# EAGLE design Shruthi-Analog-SMR4-mkII-v01 (EAGLE 5.09)
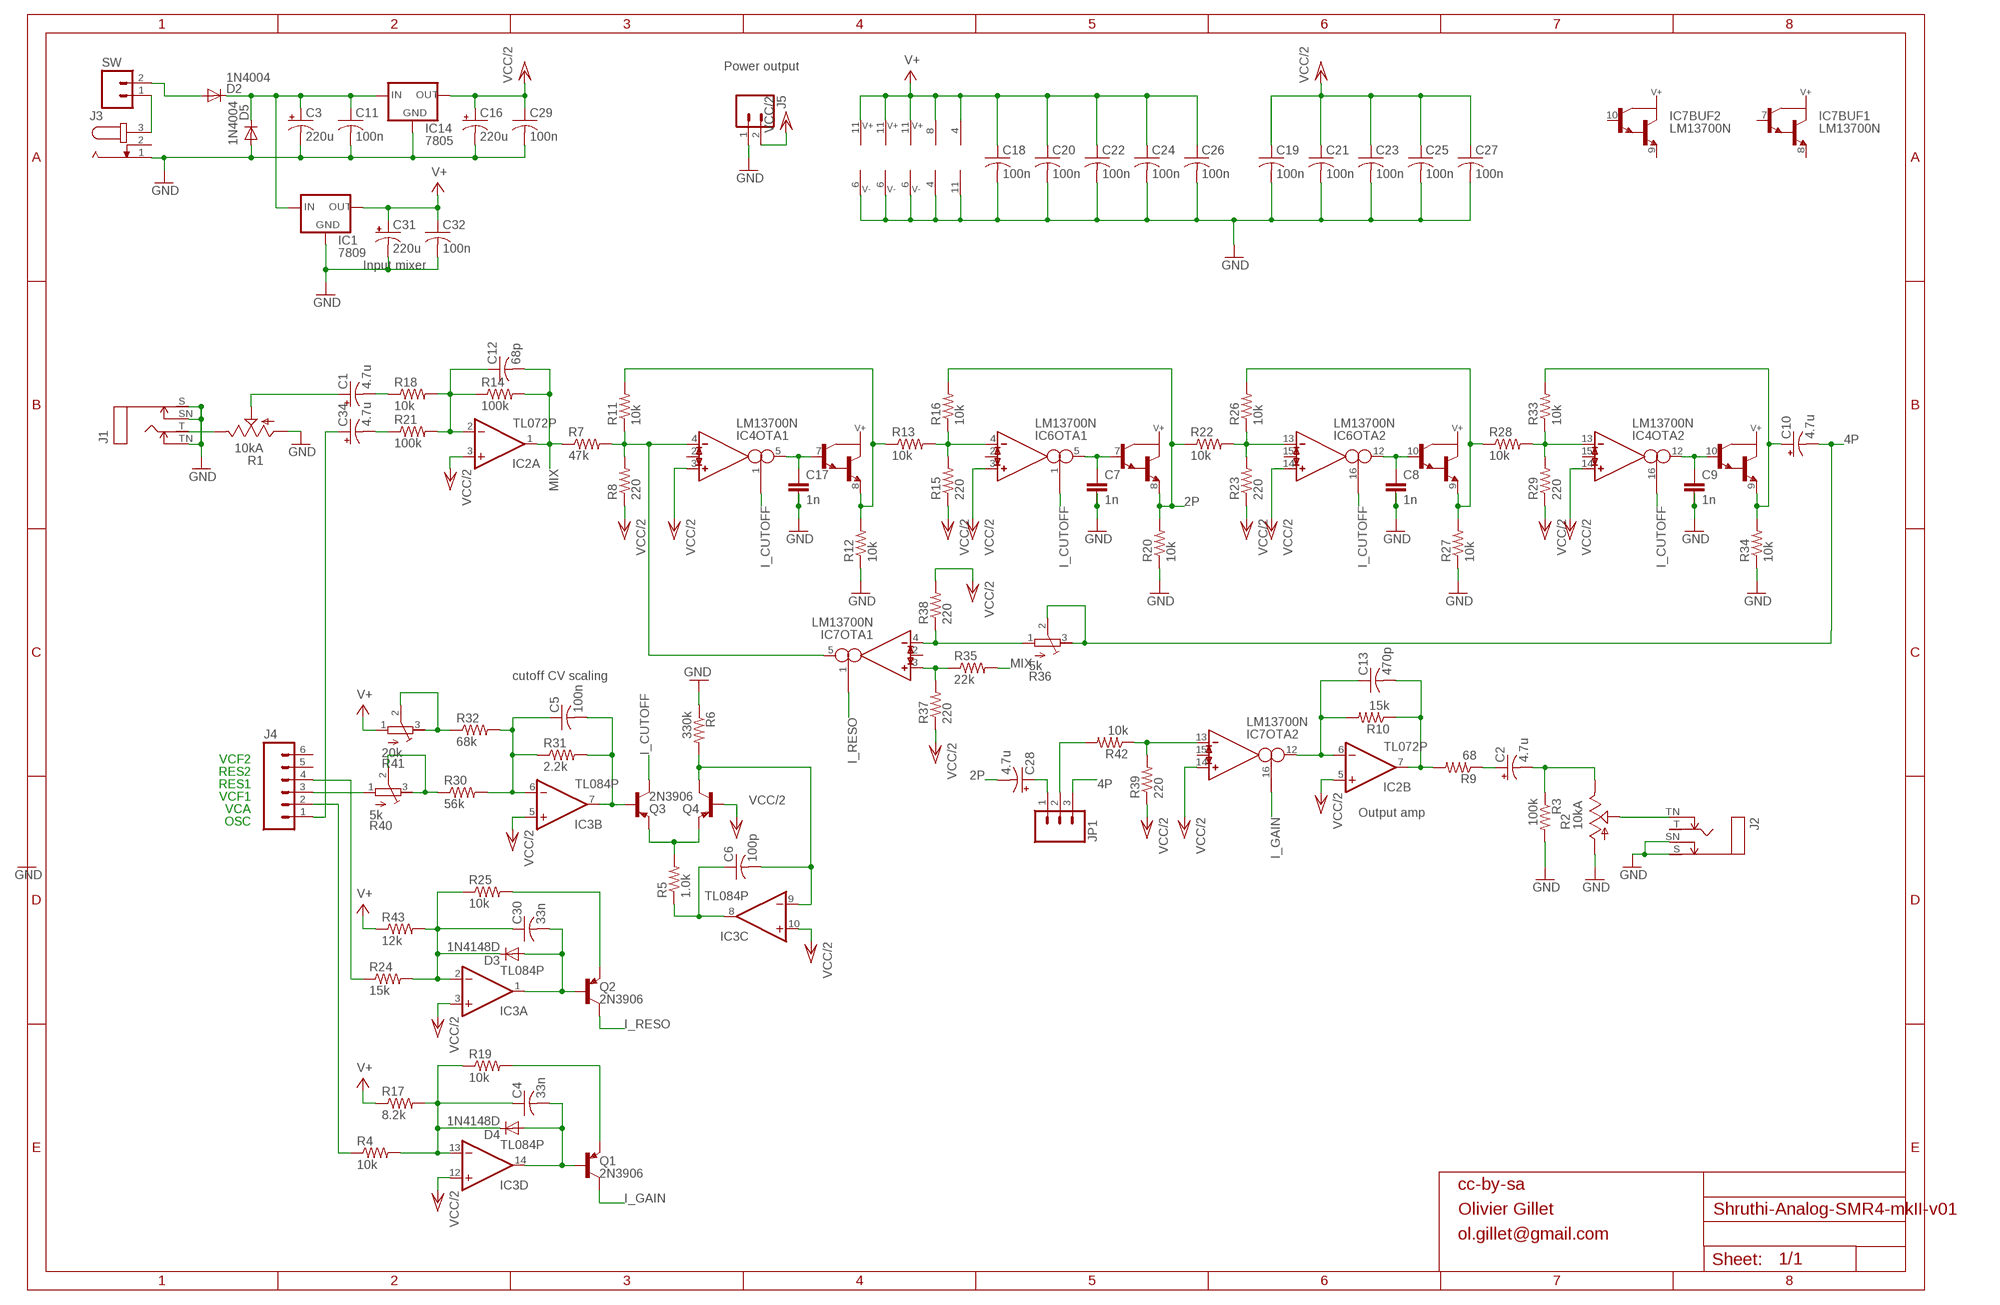
[diagram p0: schematic, sheet 1]

## Parts
C1  4.7u  CPOL-USE2.5-6  [E2,5-6]
C2  4.7u  CPOL-USE2.5-6  [E2,5-6]
C3  220u  CPOL-USE5-10.5  [E5-10,5]
C4  33n  C-US050-025X075  [C050-025X075]
C5  100n  C-US025-025X050  [C025-025X050]
C6  100p  C-US025-025X050  [C025-025X050]
C7  1n  C-2.5-5/2  [C2.5/5-2]
C8  1n  C-2.5-5/2  [C2.5/5-2]
C9  1n  C-2.5-5/2  [C2.5/5-2]
C10  4.7u  CPOL-USE2.5-6  [E2,5-6]
C11  100n  C-US025-025X050  [C025-025X050]
C12  68p  C-US025-025X050  [C025-025X050]
C13  470p  C-US025-025X050  [C025-025X050]
C16  220u  CPOL-USE5-10.5  [E5-10,5]
C17  1n  C-2.5-5/2  [C2.5/5-2]
C18  100n  C-US025-025X050  [C025-025X050]
C19  100n  C-US025-025X050  [C025-025X050]
C20  100n  C-US025-025X050  [C025-025X050]
C21  100n  C-US025-025X050  [C025-025X050]
C22  100n  C-US025-025X050  [C025-025X050]
C23  100n  C-US025-025X050  [C025-025X050]
C24  100n  C-US025-025X050  [C025-025X050]
C25  100n  C-US025-025X050  [C025-025X050]
C26  100n  C-US025-025X050  [C025-025X050]
C27  100n  C-US025-025X050  [C025-025X050]
C28  4.7u  CPOL-USE2.5-6  [E2,5-6]
C29  100n  C-US025-025X050  [C025-025X050]
C30  33n  C-US050-025X075  [C050-025X075]
C31  220u  CPOL-USE5-10.5  [E5-10,5]
C32  100n  C-US025-025X050  [C025-025X050]
C34  4.7u  CPOL-USE2.5-6  [E2,5-6]
D2  1N4004  [DO41-10]
D3  1N4148D  DIODE-D-5  [D-5]
D4  1N4148D  DIODE-D-5  [D-5]
D5  1N4004  [DO41-10]
IC1  7809  78XXS  [78XXS]
IC2  TL072P  [DIL08]
IC3  TL084P  [DIL14]
IC4  LM13700N  [DIL16]
IC6  LM13700N  [DIL16]
IC7  LM13700N  [DIL16]
IC14  7805  78XXS  [78XXS]
J1  MONOSWS  [NMJ4HC-S]
J2  MONOSWS  [NMJ4HC-S]
J3  JACK-PLUG1  [SPC4078]
J4  M06SIP  [1X06]
J5  M02PTH  [1X02]
JP1  M03PTH  [1X03]
Q1  2N3906  2N3906-  [TO92-]
Q2  2N3906  2N3906-  [TO92-]
Q3  2N3906  2N3906-  [TO92-]
Q4  2N3906  2N3906-  [TO92-]
R1  10kA  POT_USCABLED  [CABLE_POT_6MM]
R2  10kA  POT_USCABLED  [CABLE_POT_6MM]
R3  100k  R-US_0204/7  [0204/7]
R4  10k  R-US_0204/7  [0204/7]
R5  1.0k  R-US_0204/7  [0204/7]
R6  330k  R-US_0204/7  [0204/7]
R7  47k  R-US_0204/7  [0204/7]
R8  220  R-US_0204/7  [0204/7]
R9  68  R-US_0204/7  [0204/7]
R10  15k  R-US_0204/7  [0204/7]
R11  10k  R-US_0204/7  [0204/7]
R12  10k  R-US_0204/7  [0204/7]
R13  10k  R-US_0204/7  [0204/7]
R14  100k  R-US_0204/7  [0204/7]
R15  220  R-US_0204/7  [0204/7]
R16  10k  R-US_0204/7  [0204/7]
R17  8.2k  R-US_0204/7  [0204/7]
R18  10k  R-US_0204/7  [0204/7]
R19  10k  R-US_0204/7  [0204/7]
R20  10k  R-US_0204/7  [0204/7]
R21  100k  R-US_0204/7  [0204/7]
R22  10k  R-US_0204/7  [0204/7]
R23  220  R-US_0204/7  [0204/7]
R24  15k  R-US_0204/7  [0204/7]
R25  10k  R-US_0204/7  [0204/7]
R26  10k  R-US_0204/7  [0204/7]
R27  10k  R-US_0204/7  [0204/7]
R28  10k  R-US_0204/7  [0204/7]
R29  220  R-US_0204/7  [0204/7]
R30  56k  R-US_0204/7  [0204/7]
R31  2.2k  R-US_0204/7  [0204/7]
R32  68k  R-US_0204/7  [0204/7]
R33  10k  R-US_0204/7  [0204/7]
R34  10k  R-US_0204/7  [0204/7]
R35  22k  R-US_0204/7  [0204/7]
R36  5k  R-TRIMM3296W  [RTRIM3296W]
R37  220  R-US_0204/7  [0204/7]
R38  220  R-US_0204/7  [0204/7]
R39  220  R-US_0204/7  [0204/7]
R40  5k  R-TRIMM3296W  [RTRIM3296W]
R41  20k  R-TRIMM3296W  [RTRIM3296W]
R42  10k  R-US_0204/7  [0204/7]
R43  12k  R-US_0204/7  [0204/7]
SW  M02PTH  [1X02]

## Nets
2P: C28.- IC6.8(BUF1:E) R16.2 R20.2 R22.1
4P: C10.- JP1.3 R36.2(S) R36.3(A)
GND: C3.- C7.2 C7.3 C8.2 C8.3 C9.2 C9.3 C11.2 C16.- C17.2 C17.3 C18.2 C19.2 C20.2 C21.2 C22.2 C23.2 C24.2 C25.2 C26.2 C27.2 C29.2 C31.- C32.2 D5.A IC1.GND IC2.4(P:V-) IC3.11(P:V-) IC4.6(SUPPLY:V-) IC6.6(SUPPLY:V-) IC7.6(SUPPLY:V-) IC14.GND J1.S J1.SN J1.TN J2.S J2.SN J3.1 J5.1 R1.A R2.A R3.2 R6.1 R12.1 R20.1 R27.1 R34.1
I_CUTOFF: IC4.1(OTA1:I_BIAS) IC4.16(OTA2:I_BIAS) IC6.1(OTA1:I_BIAS) IC6.16(OTA2:I_BIAS) Q3.1(C)
I_GAIN: IC7.16(OTA2:I_BIAS) Q1.1(C)
I_RESO: IC7.1(OTA1:I_BIAS) Q2.1(C)
MIX: C12.2 IC2.1(A:OUT) R7.1 R14.2 R35.2
N$1: D2.A SW.2
N$2: C5.2 IC3.7(B:OUT) Q3.2(B) R31.2
N$3: J3.3 SW.1
N$4: C3.+ C11.1 D2.C D5.C IC1.IN IC14.IN
N$5: J4.3 R40.1(E)
N$6: C12.1 IC2.2(A:-IN) R14.1 R18.2 R21.2
N$7: Q3.3(E) Q4.3(E) R5.2
N$8: JP1.2 R42.2
N$9: C6.1 IC3.8(C:OUT) R5.1
N$10: C6.2 IC3.9(C:-IN) Q4.1(C) R6.2
N$11: J4.4 R24.1
N$12: IC4.4(OTA1:IN_N) IC7.5(OTA1:OUT) R7.2 R8.2 R11.1
N$14: IC4.8(BUF1:E) R11.2 R12.2 R13.1
N$16: IC6.4(OTA1:IN_N) R13.2 R15.2 R16.1
N$17: C28.+ JP1.1
N$19: C7.1 IC6.5(OTA1:OUT) IC6.7(BUF1:B)
N$20: IC6.13(OTA2:IN_N) R22.2 R23.2 R26.1
N$23: C8.1 IC6.10(BUF2:B) IC6.12(OTA2:OUT)
N$24: IC4.13(OTA2:IN_N) R28.2 R29.2 R33.1
N$25: C2.+ R9.1
N$26: IC6.9(BUF2:E) R26.2 R27.2 R28.1
N$27: C10.+ IC4.9(BUF2:E) R33.2 R34.2
N$28: C9.1 IC4.10(BUF2:B) IC4.12(OTA2:OUT)
N$29: IC7.4(OTA1:IN_N) R36.1(E) R38.1
N$30: C30.2 D3.A IC3.1(A:OUT) Q2.2(B)
N$31: C4.2 D4.A IC3.14(D:OUT) Q1.2(B)
N$32: C2.- R2.E R3.1
N$33: IC7.3(OTA1:IN_P) R35.1 R37.2
N$34: IC7.13(OTA2:IN_N) R39.2 R42.1
N$35: C34.+ J4.1
N$38: J1.T R1.E
N$39: C34.- R21.1
N$40: C5.1 IC3.6(B:-IN) R30.2 R31.1 R32.2
N$41: R30.1 R40.2(S) R40.3(A)
N$43: R32.1 R41.2(S) R41.3(A)
N$45: J4.2 R4.1
N$47: J2.TN R2.S
N$51: C4.1 D4.C IC3.13(D:-IN) R4.2 R17.2 R19.1
N$57: C30.1 D3.C IC3.2(A:-IN) R24.2 R25.1 R43.2
N$60: Q2.3(E) R25.2
N$63: C13.2 IC2.7(B:OUT) R9.2 R10.1
N$64: C17.1 IC4.5(OTA1:OUT) IC4.7(BUF1:B)
N$66: C1.+ R1.S
N$68: Q1.3(E) R19.2
N$70: C13.1 IC2.6(B:-IN) IC7.12(OTA2:OUT) R10.2
N$72: C1.- R18.1
V+: C18.1 C20.1 C22.1 C24.1 C26.1 C31.+ C32.1 IC1.OUT IC2.8(P:V+) IC3.4(P:V+) IC4.11(SUPPLY:V+) IC6.11(SUPPLY:V+) IC7.11(SUPPLY:V+) R17.1 R41.1(E) R43.1
VCC/2: C16.+ C19.1 C21.1 C23.1 C25.1 C27.1 C29.1 IC2.3(A:+IN) IC2.5(B:+IN) IC3.3(A:+IN) IC3.5(B:+IN) IC3.10(C:+IN) IC3.12(D:+IN) IC4.3(OTA1:IN_P) IC4.14(OTA2:IN_P) IC6.3(OTA1:IN_P) IC6.14(OTA2:IN_P) IC7.14(OTA2:IN_P) IC14.OUT J5.2 Q4.2(B) R8.1 R15.1 R23.1 R29.1 R37.1 R38.2 R39.1
Unconnected: IC4.2(OTA1:I_DIODE) IC4.15(OTA2:I_DIODE) IC6.2(OTA1:I_DIODE) IC6.15(OTA2:I_DIODE) IC7.2(OTA1:I_DIODE) IC7.7(BUF1:B) IC7.8(BUF1:E) IC7.9(BUF2:E) IC7.10(BUF2:B) IC7.15(OTA2:I_DIODE) J2.T J3.2 J4.5 J4.6

## Notes on the sheet
- Power output
- Input mixer
- cutoff CV scaling
- VCF2
- RES2
- RES1
- VCF1
- VCA
- OSC | Output amp
- cc-by-sa
- Olivier Gillet
- ol.gillet@gmail.com

## Library data of the parts
C1-C3 C10 C16 C28 C31 C34 = rcl:CPOL-US: POLARIZED CAPACITOR, American symbol
C4-C6 C11-C13 C18-C27 C29 C30 C32 = rcl:C-US: CAPACITOR, American symbol
C7-C9 C17 = capacitor-wima:C-: CAPACITOR for alternative placement naming: default grid - extended grid/package width
D2 D5 = diode:1N4004: DIODE general purpose rectifier, 1 A
D3 D4 = diode:DIODE-: DIODE
IC1 IC14 = v-reg:78XXS: VOLTAGE REGULATOR
IC2 = gm-ics:TL072: OP AMP
IC3 = linear:TL084: OP AMP
IC4 IC6 IC7 = ota:LM13700: Dual OTA with buffers
J1 J2 = gm-jacks:MONOSW
J3 = con-jack2:JACK-PLUG: DC POWER JACK Power Jack, DC, Right Angle, Through Hole, Rated 5A at 16VDC, PC Terminals Distributor: Farnell (www.Farnell.de) Drawing: 84N1161.pdf / 84N1162.pdf Manufacturer: SPC Technology (www.spctechnology.com) Type: SPC4077 / SPC 4078
J4 = SparkFun:M06: Header 6 Standard 6-pin 0.1" header. Use with straight break away headers (SKU : PRT-00116), right angle break away headers (PRT-00553), swiss pins (PRT-00743), machine pins (PRT-00117), and female headers (PRT-00115). Molex polarized connector foot print use with SKU : PRT-08094 with associated crimp pins and housings. NOTES ON THE VARIANTS LOCK and LOCK_LONGPADS... This footprint was designed to help hold the alignment of a through-hole component (i.e. 6-pin header) while soldering it into place. You may notice that each hole has been shifted either up or down by 0.005 of an inch from it's more standard position (which is a perfectly straight line). This slight alteration caused the pins (the squares in the middle) to touch the edges of the holes. Because they are alternating, it causes a "brace" to hold the component in place. 0.005 has proven to be the perfect amount of "off-center" position when using our standard breakaway headers. Although looks a little odd when you look at the bare footprint, once you have a header in there, the alteration is very hard to notice. Also, if you push a header all the way into place, it is covered up entirely on the bottom side. This idea of altering the position of holes to aid alignment will be further integrated into the Sparkfun Library for other footprints. It can help hold any component with 3 or more connection pins.
J5 SW = SparkFun:M02: Header 2 Standard 2-pin 0.1" header. Use with straight break away headers (SKU : PRT-00116), right angle break away headers (PRT-00553), swiss pins (PRT-00743), machine pins (PRT-00117), and female headers (PRT-00115). Molex polarized connector foot print use with SKU : PRT-08233 with associated crimp pins and housings.
JP1 = SparkFun:M03: Header 3 Standard 3-pin 0.1" header. Use with straight break away headers (SKU : PRT-00116), right angle break away headers (PRT-00553), swiss pins (PRT-00743), machine pins (PRT-00117), and female headers (PRT-00115). Molex polarized connector foot print use with SKU : PRT-08232 with associated crimp pins and housings.
Q1-Q4 = gm-trans:2N3906: PNP Transistor
R1 R2 = pot-cable:POT_US
R3-R35 R37-R39 R42 R43 = rcl:R-US_: RESISTOR, American symbol
R36 R40 R41 = rcl:R-TRIMM: Trimm resistor

## Board
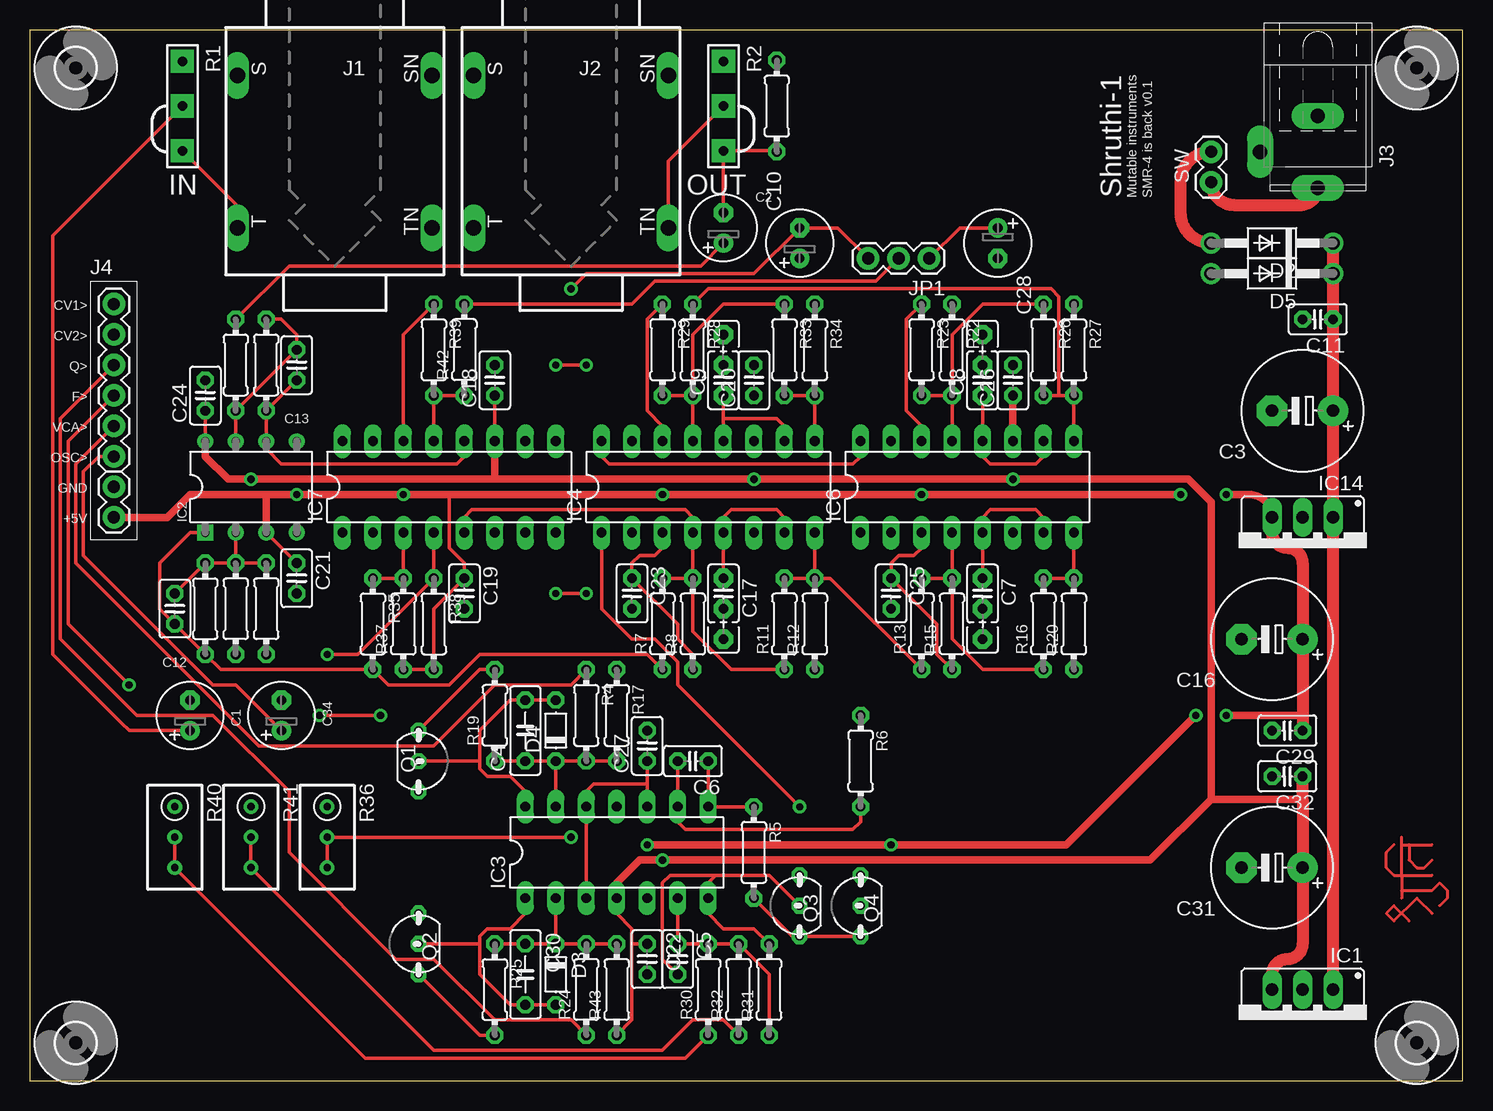
[diagram p1: board, top side]
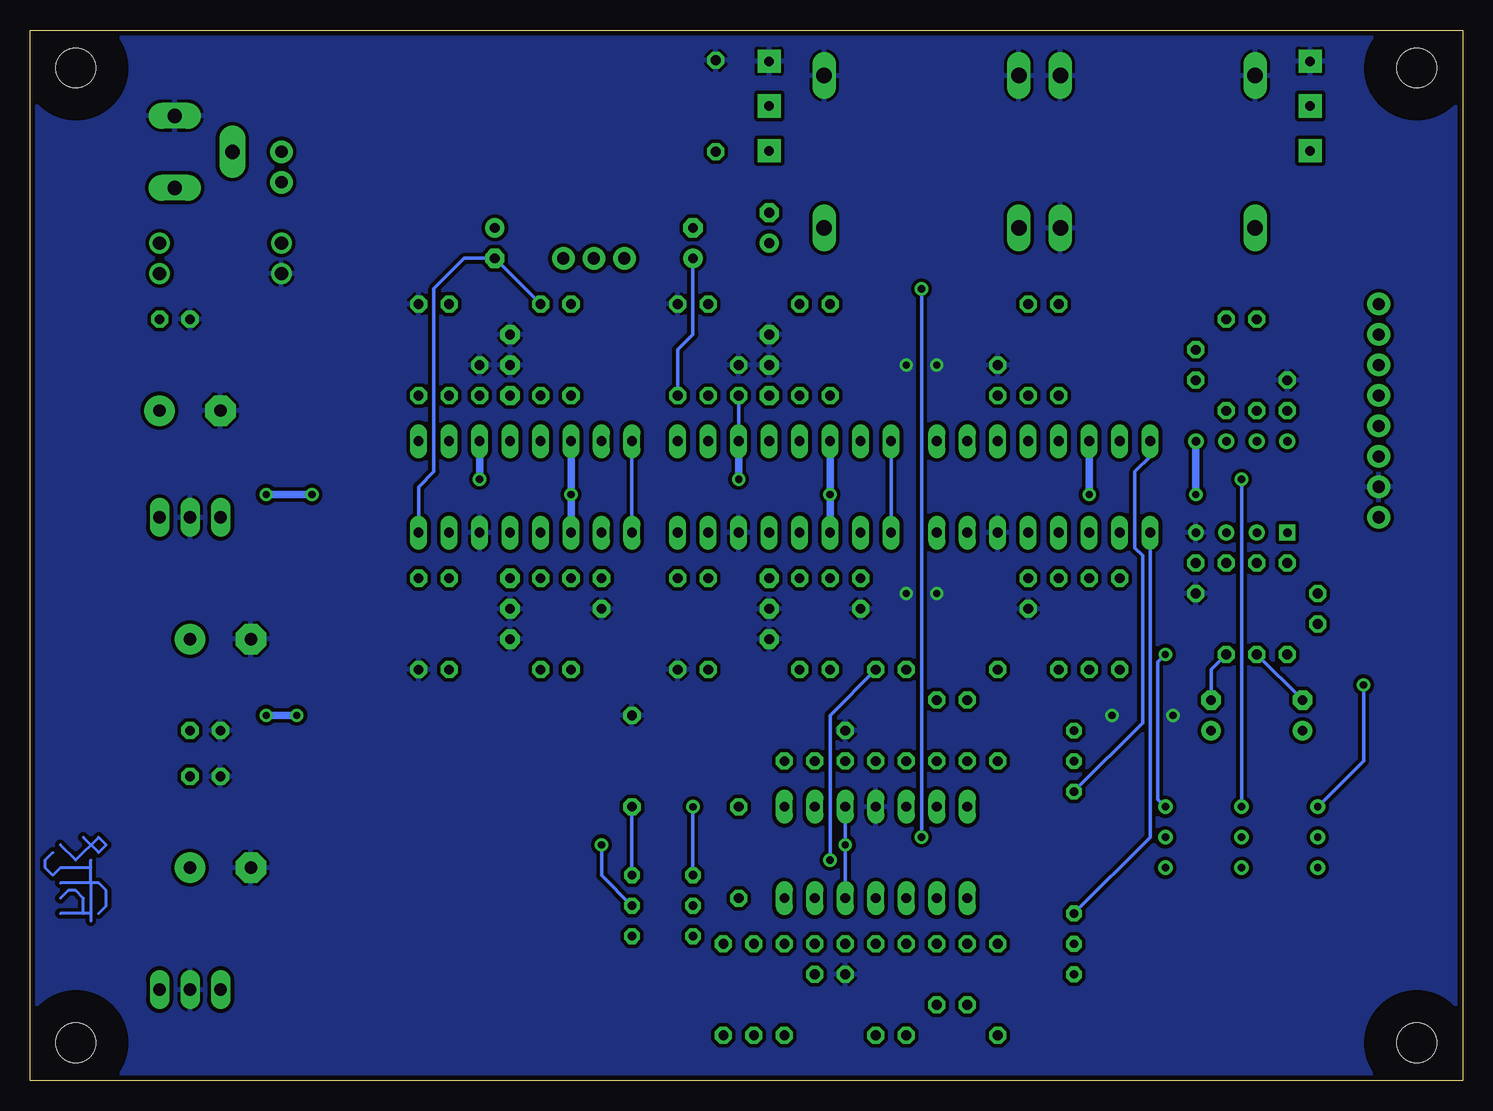
[diagram p2: board, bottom side, seen from below]

Size 119.38 x 87.62 mm. Coordinates in mm from the lower left corner, seen from the top.
Outline: 0,0 119.38,0 119.38,87.62 0,87.62 0,0
Copper layers (1*16): Top 0.035mm / dielectric 1.5mm / Bottom 0.035mm
Design rules "SparkFun_10mil *": minimum track width 10mil, minimum drill 20mil, track to track 10mil, track to pad 10mil, pad to pad 10mil, via to via 10mil, smd to smd 10mil, copper to edge 10mil, drill to drill 10mil, minimum pad ring 12mil, minimum via ring 10mil, stop-mask expansion 4mil, vias tented up to drill 25mil, thermal gap 10mil

### Footprints (pad centres in the part's own frame; a part is rotated, then mirrored left to right if it is on the bottom)
E2,5-6 = drill 0.813 pad 1.6 round: + -1.27,0 | drill 0.813 pad 1.6 octagon: - 1.27,0
E5-10,5 = drill 1.016 pad 2.54 round: + -2.54,0 | drill 1.016 pad 2.54 octagon: - 2.54,0
C050-025X075 = drill 0.813 octagon: 1 -2.54,0; 2 2.54,0
C025-025X050 = drill 0.813 octagon: 1 -1.27,0; 2 1.27,0
C2.5/5-2 = drill 0.813 pad 1.6 octagon: 1 -1.27,0; 2 1.27,0; 3 3.81,0
DO41-10 = drill 1.118 round: A 5.08,0; C -5.08,0
D-5 = drill 0.813 octagon: A 2.54,0; C -2.54,0
78XXS = drill 1.016 long: GND 0,-2.54; IN -2.54,-2.54; OUT 2.54,-2.54
DIL08 = drill 0.7 square: 1 -3.81,-3.81 | drill 0.7 round: 2 -1.27,-3.81; 3 1.27,-3.81; 4 3.81,-3.81; 5 3.81,3.81; 6 1.27,3.81; 7 -1.27,3.81; 8 -3.81,3.81
DIL14 = drill 0.813 long: 1 -7.62,-3.81; 2 -5.08,-3.81; 3 -2.54,-3.81; 4 0,-3.81; 5 2.54,-3.81; 6 5.08,-3.81; 7 7.62,-3.81; 8 7.62,3.81; 9 5.08,3.81; 10 2.54,3.81; 11 0,3.81; 12 -2.54,3.81; 13 -5.08,3.81; 14 -7.62,3.81
DIL16 = drill 0.813 long: 1 -8.89,-3.81; 2 -6.35,-3.81; 3 -3.81,-3.81; 4 -1.27,-3.81; 5 1.27,-3.81; 6 3.81,-3.81; 7 6.35,-3.81; 8 8.89,-3.81; 9 8.89,3.81; 10 6.35,3.81; 11 3.81,3.81; 12 1.27,3.81; 13 -1.27,3.81; 14 -3.81,3.81; 15 -6.35,3.81; 16 -8.89,3.81
NMJ4HC-S = drill 1.3 long: S 5.08,8.115; SN 5.08,-8.115; T -7.62,8.115; TN -7.62,-8.115
SPC4078_LARGER_HOLES = drill 1.2 pad 2.184 long: 1 -3,0; 2 0,-4.8; 3 3,0
1X06 = drill 1.016 pad 1.88 round: 1 0,0; 2 2.54,0; 3 5.08,0; 4 7.62,0; 5 10.16,0; 6 12.7,0
1X02 = drill 1.016 pad 1.88 round: 1 0,0; 2 2.54,0
1X03 = drill 1.016 pad 1.88 round: 1 0,0; 2 2.54,0; 3 5.08,0
TO92- = drill 0.7 octagon: 1 2.54,0; 2 0,0; 3 -2.54,0
CABLE_POT_6MM = drill 0.8 pad 1.93 square: A -3.73,0; E 3.73,0; S 0,0
0204/7 = drill 0.813 octagon: 1 -3.81,0; 2 3.81,0
RTRIM3296W = drill 0.61 round: 1 0,-2.54; 2 0,0; 3 0,2.54
3,3 = hole 3.3: 0,0

### Placement (x,y rotation side)
C1  13.34,30.48 90 top
C2  57.78,71.12 90 top
C3  106.05,55.88 180 top
C4  41.27,29.21 90 top
C5  53.98,10.16 270 top
C6  55.24,26.67 180 top
C7  79.38,40.64 270 top
C8  79.38,58.42 90 top
C9  57.78,58.42 90 top
C10  64.14,69.85 90 top
C11  107.31,63.5 180 top
C12  12.07,39.37 270 top
C13  22.23,59.69 90 top
C16  103.5,36.83 180 top
C17  57.78,40.64 270 top
C18  38.73,58.42 90 top
C19  36.2,40.64 270 top
C20  60.33,58.42 90 top
C21  22.23,41.91 270 top
C22  51.44,10.16 270 top
C23  50.16,40.64 270 top
C24  14.61,57.15 90 top
C25  71.75,40.64 270 top
C26  81.92,58.42 90 top
C27  51.44,27.94 90 top
C28  80.64,69.85 270 top
C29  104.78,29.21 180 top
C30  41.27,8.89 270 top
C31  103.5,17.78 180 top
C32  104.78,25.4 180 top
C34  20.96,30.48 90 top
D2  103.5,69.85 180 top
D3  43.81,8.89 270 top
D4  43.81,29.21 90 top
D5  103.5,67.31 180 top
IC1  106.05,5.08 180 top
IC2  18.41,49.53 0 top
IC3  48.89,19.05 0 top
IC4  56.52,49.53 0 top
IC6  78.11,49.53 0 top
IC7  34.93,49.53 0 top
IC14  106.05,44.45 180 top
J1  25.4,78.74 90 top
J2  45.09,78.74 90 top
J3  [SPC4078_LARGER_HOLES]  107.31,77.47 270 top
J4  6.99,52.07 90 top
J5  6.99,49.53 270 top
JP1  74.93,68.58 180 top
Q1  32.38,26.67 270 top
Q2  32.38,11.43 90 top
Q3  64.14,14.61 90 top
Q4  69.22,14.61 90 top
R1  12.7,81.28 270 top
R2  57.78,81.28 270 top
R3  62.23,81.28 90 top
R4  46.35,30.48 270 top
R5  60.33,19.05 270 top
R6  69.22,26.67 270 top
R7  52.7,38.1 90 top
R8  55.24,38.1 90 top
R9  17.14,59.69 270 top
R10  19.68,59.69 270 top
R11  62.87,38.1 90 top
R12  65.41,38.1 90 top
R13  74.3,38.1 90 top
R14  14.61,39.37 270 top
R15  76.83,38.1 90 top
R16  84.45,38.1 90 top
R17  48.89,30.48 270 top
R18  17.14,39.37 90 top
R19  38.73,30.48 90 top
R20  87,38.1 90 top
R21  19.68,39.37 90 top
R22  76.83,60.96 270 top
R23  74.3,60.96 270 top
R24  46.35,7.62 90 top
R25  38.73,7.62 270 top
R26  84.45,60.96 270 top
R27  87,60.96 270 top
R28  55.24,60.96 270 top
R29  52.7,60.96 270 top
R30  56.52,7.62 90 top
R31  61.59,7.62 90 top
R32  59.05,7.62 90 top
R33  62.87,60.96 270 top
R34  65.41,60.96 270 top
R35  28.57,38.1 270 top
R36  24.77,20.32 180 top
R37  31.11,38.1 90 top
R38  33.66,38.1 270 top
R39  33.66,60.96 270 top
R40  12.07,20.32 180 top
R41  18.41,20.32 180 top
R42  36.2,60.96 90 top
R43  48.89,7.62 90 top
SW  98.42,74.93 90 top
U$1  [3,3]  3.81,84.45 0 top
U$2  [3,3]  115.57,84.45 0 top
U$5  [3,3]  3.81,3.17 0 top
U$6  [3,3]  115.57,3.17 0 top

### Tracks (layer width: path | path; a pad name or v marks a point on that pad's centre or on a via)
2P
  Top 0.305: IC6.8 R20.2 R16.2
  Bottom 0.305: R22.1 C28.- 83.19,68.58 85.72,66.04 85.72,50.8 87,49.53 IC6.8
4P  (via drill 0.6)
  Top 0.305: JP1.3 67.31,71.12 C10.- 60.33,67.31 46.35,67.31 v45.09,66.04 | R36.3 R36.2 v45.09,20.32
  Bottom 0.305: v45.09,20.32 v45.09,66.04
GND  (via drill 0.6)
  Top 0.305: v24.13,30.48 v29.21,30.48 | v43.81,59.69 v46.35,59.69 | v43.81,40.64 v46.35,40.64
  pour Bottom (isolate 0.305): 0.64,87 0.64,0.64 118.75,0.64 118.75,87
I_CUTOFF  (via drill 0.6)
  Top 0.305: IC4.16 47.62,52.07 48.26,51.44 68.58,51.44 69.22,52.07 IC6.16 | v64.14,22.86 53.98,33.02 53.98,34.92 52.07,36.83 50.16,36.83 47.62,39.37 IC4.1
  Bottom 0.305: IC6.16 IC6.1 | IC4.1 IC4.16 | Q3.1 v64.14,22.86
I_GAIN
  Bottom 0.305: Q1.1 26.67,29.84 26.67,43.82 27.3,44.45 27.3,50.8 26.04,52.07 IC7.16
I_RESO
  Bottom 0.305: IC7.1 26.04,20.32 Q2.1
MIX
  Top 0.305: IC2.1 13.34,45.72 10.79,43.18 10.79,39.37 C12.2 R14.2 15.88,34.29 R35.2 29.84,33.02 34.93,33.02 37.47,35.56 51.44,35.56 R7.1
N$1
  Top 1.016: SW.2 arc90 95.89,74.93 95.89,72.39 arc90 D2.A
N$2
  Top 0.305: R31.2 60.33,12.7 57.78,12.7 56.52,13.97 IC3.7 56.52,16.51 57.15,17.14 | C5.2 52.7,10.16 52.7,16.51 53.34,17.14 57.15,17.14 | Q3.2 61.59,17.14 57.15,17.14
N$3
  Top 1.016: J3.3 arc-90 105.87,73.03 100.33,73.03 arc-90 SW.1
N$4
  Top 1.016: D2.C D5.C C11.1 C3.+ IC14.IN IC1.IN
N$5  (via drill 0.6)
  Top 0.305: J4.3 3.18,53.34 3.18,38.1 v8.26,33.02
  Bottom 0.305: R40.1 8.26,26.67 v8.26,33.02
N$6
  Top 0.305: R18.2 IC2.2 | R18.2 R14.1 C12.1 | R18.2 R21.2
N$7
  Top 0.305: Q4.3 Q3.3 63.5,12.07 R5.2
N$8
  Top 0.305: JP1.2 70.48,66.67 52.07,66.67 50.16,64.77 R42.2
N$9
  Top 0.305: C6.1 IC3.8 R5.1
N$10
  Top 0.305: R6.2 69.22,21.59 68.58,20.95 54.61,20.95 53.98,21.59 IC3.9 C6.2
  Bottom 0.305: R6.2 Q4.1
N$11
  Top 0.305: J4.4 2.54,55.25 2.54,36.83 8.89,30.48 15.24,30.48 21.59,24.13 21.59,19.05 30.48,10.16 33.66,10.16 38.73,5.08 45.09,5.08 R24.1
N$12
  Top 0.305: R8.2 IC4.4 55.24,46.99 54.61,47.62 36.83,47.62 36.2,46.99 IC7.5 | R8.2 R7.2 | R8.2 55.24,37.47 58.42,34.29 R11.1
N$14
  Top 0.305: R12.2 IC4.8 | R11.2 R12.2 | R13.1 66.67,41.91 R12.2
N$15
  Bottom 0.254: 116.84,19.68 115.57,18.41 113.67,20.32 113.03,19.68 113.67,19.05 114.94,20.32
N$16
  Top 0.305: R16.1 79.38,34.29 76.83,36.83 R15.2 | R15.2 IC6.4 | R15.2 R13.2
N$17
  Top 0.305: JP1.1 77.47,71.12 C28.+
N$19
  Top 0.305: IC6.7 84.45,46.99 83.82,47.62 80.01,47.62 79.38,46.99 IC6.5 C7.1
N$20
  Top 0.305: R22.2 R23.2 | IC6.13 R22.2 | R22.2 76.83,62.23 79.38,64.77 R26.1
N$23
  Top 0.305: C8.1 IC6.12 79.38,52.07 80.01,51.44 83.82,51.44 84.45,52.07 IC6.10
N$24
  Top 0.305: R28.2 R29.2 | IC4.13 R28.2 | R33.1 57.78,64.77 55.24,62.23 R28.2
N$25
  Top 0.305: C2.+ 55.88,67.95 21.59,67.95 R9.1
N$26
  Top 0.305: IC6.9 R27.2 85.72,57.15 | 85.72,57.15 R26.2 | R28.1 56.52,66.04 85.09,66.04 85.72,65.41 85.72,57.15
N$27
  Top 0.305: IC4.9 R34.2 R33.2
  Bottom 0.305: C10.+ 64.14,62.23 65.41,60.96 R34.2
N$28
  Top 0.305: 57.78,55.25 IC4.12 57.78,52.07 | 57.78,55.25 C9.1 | IC4.10 62.87,54.61 62.23,55.25 57.78,55.25
N$29  (via drill 0.6)
  Top 0.305: IC7.4 R38.1 27.3,35.56 v24.77,35.56
  Bottom 0.305: R36.1 25.4,23.49 25.4,34.92 v24.77,35.56
N$30
  Top 0.305: IC3.1 41.27,13.97 40.01,12.7 38.1,12.7 37.47,12.07 37.47,11.43 | 37.47,11.43 37.47,8.89 40.01,6.35 C30.2 D3.A | Q2.2 37.47,11.43
N$31
  Top 0.305: D4.A C4.2 40.01,31.75 37.47,29.21 37.47,26.67 | IC3.14 41.27,24.13 40.01,25.4 38.1,25.4 37.47,26.04 37.47,26.67 | Q1.2 37.47,26.67
N$32
  Top 0.254: 62.15,77.55 R3.1
  Top 0.305: 62.15,77.55 R2.E C2.-
N$33
  Top 0.305: R35.1 R37.2 IC7.3
N$34
  Top 0.305: R42.1 R39.2 IC7.13
N$35
  Top 0.305: J4.1 5.71,52.07 4.45,50.8 4.45,43.82 15.24,33.02 17.14,33.02 C34.+
N$38
  Top 0.305: R1.E 17.29,72.97 J1.T
N$39
  Bottom 0.305: C34.- 20.96,34.29 R21.1
N$40
  Top 0.305: IC3.6 C5.1 R30.2 R32.2 61.59,8.89 R31.1
N$41
  Top 0.305: R30.1 54.61,1.91 27.94,1.91 R40.3 R40.2
N$43
  Top 0.305: R41.2 R41.3 33.66,2.54 52.7,2.54 55.24,5.08 57.78,5.08 R32.1
N$45
  Top 0.305: J4.2 3.81,51.44 3.81,43.18 19.05,27.94 33.66,27.94 38.73,33.02 45.09,33.02 R4.1
N$47
  Top 0.305: R2.S 53.2,76.7 J2.TN
N$51
  Top 0.305: IC3.13 D4.C | D4.C C4.1 R19.1 | D4.C R4.2 R17.2
N$52
  Bottom 0.254: 114.3,17.78 114.3,18.41 | 114.3,16.51 114.3,17.78 | 114.3,16.51 114.3,13.97 | 114.3,13.97 114.3,13.34 | 114.94,13.97 116.84,13.97 | 114.3,13.97 114.94,13.97 | 114.94,13.97 114.94,15.24 115.57,15.88 116.2,15.88 116.84,15.24 | 114.3,17.78 116.84,17.78 117.47,17.14 118.11,17.78 118.11,18.41 117.47,19.05 | 114.3,16.51 116.84,16.51 | 114.3,16.51 113.67,16.51 113.03,15.88 113.03,14.61 113.67,13.97
N$53
  Top 0.254: 116.84,13.97 115.57,15.24 113.67,13.34 113.03,13.97 113.67,14.61 114.94,13.34
N$54
  Top 0.254: 114.3,15.88 114.3,15.24 | 114.3,17.14 114.3,15.88 | 114.3,17.14 114.3,19.68 | 114.3,19.68 114.3,20.32 | 114.94,19.68 116.84,19.68 | 114.3,19.68 114.94,19.68 | 114.94,19.68 114.94,18.41 115.57,17.78 116.2,17.78 116.84,18.41 | 114.3,15.88 116.84,15.88 117.47,16.51 118.11,15.88 118.11,15.24 117.47,14.61 | 114.3,17.14 116.84,17.14 | 114.3,17.14 113.67,17.14 113.03,17.78 113.03,19.05 113.67,19.68
N$57
  Top 0.305: D3.C IC3.2 | D3.C R24.2 R43.2 | D3.C C30.1 R25.1
N$60
  Top 0.305: Q2.3 37.47,3.81 R25.2
N$63
  Top 0.305: IC2.7 R9.2 C13.2 22.23,62.23 20.96,63.5 R10.1
N$64
  Top 0.305: IC4.7 62.87,46.99 62.23,47.62 58.42,47.62 57.78,46.99 IC4.5 C17.1
N$66
  Top 0.305: C1.+ 8.26,29.21 7.62,29.84 1.91,35.56 1.91,70.48 R1.S
N$68
  Top 0.305: Q1.3 37.47,34.29 R19.2
N$70
  Top 0.305: C13.1 R10.2 IC2.6 19.68,52.71 20.96,51.44 35.56,51.44 36.2,52.07 IC7.12
N$72
  Bottom 0.305: C1.- R18.1
V+  (via drill 0.6)
  Top 0.305: IC2.8 C24.1 | IC7.11 C18.1 | IC3.4 48.89,13.97 50.16,12.7 50.16,11.43 | 50.16,11.43 50.16,5.08 R43.1 | 50.16,11.43 C22.1
  Top 0.61: IC2.8 14.61,52.07 16.51,50.16 v18.41,50.16 38.73,50.16 | 38.73,50.16 v60.33,50.16 v81.92,50.16 96.52,50.16 98.42,48.26 98.42,23.49 | 38.73,50.16 IC7.11 | IC6.11 C26.1 | 98.42,23.49 93.34,18.41 v52.7,18.41 50.8,18.41 48.89,16.51 IC3.4 | 98.42,23.49 106.05,23.49
  Top 1.016: IC1.OUT 103.5,8.89 arc-90 104.78,10.16 arc90 106.05,11.43 C31.+ 106.05,23.49 C32.1
  Bottom 0.305: R41.1 v18.41,50.16 | IC4.11 C20.1 | R17.1 52.7,30.48 v52.7,18.41
  Bottom 0.61: v81.92,50.16 IC6.11 | v60.33,50.16 IC4.11
VCC/2  (via drill 0.6)
  Top 0.305: IC7.14 31.11,62.23 R39.1 | R29.1 51.44,63.5 51.44,55.88 52.7,54.61 IC4.14 | R23.1 73.03,63.5 73.03,55.88 74.3,54.61 IC6.14 | R15.1 75.56,35.56 75.56,38.1 C25.1 71.75,43.18 72.39,43.82 73.66,43.82 74.3,44.45 IC6.3 | R8.1 55.24,35.56 53.98,36.83 53.98,38.1 C23.1 50.16,43.18 50.8,43.82 52.07,43.82 52.7,44.45 IC4.3 | R37.1 R38.2 33.66,39.37 C19.1 36.2,43.18 34.93,44.45 34.93,48.9 | IC2.3 C21.1 | IC3.3 IC3.12 46.35,24.13 46.99,24.76 51.44,24.76 | IC3.10 51.44,24.76 | 51.44,24.76 C27.1
  Top 0.61: 19.68,48.9 IC2.3 | 19.68,48.9 v22.23,48.9 v31.11,48.9 34.93,48.9 v52.7,48.9 v74.3,48.9 v95.89,48.9 | v99.69,48.9 101.6,48.9 arc-90 IC14.OUT | J5.2 11.43,46.99 13.34,48.9 19.68,48.9 | 106.05,30.48 v99.69,30.48 | v97.16,30.48 86.36,19.68 v71.75,19.68 v51.44,19.68
  Top 1.016: IC14.OUT 103.5,45.72 arc90 104.78,44.45 arc-90 106.05,43.18 C16.+ 106.05,30.48 C29.1
  Bottom 0.305: IC3.10 v51.44,19.68 IC3.5 | Q4.2 71.75,17.14 v71.75,19.68
  Bottom 0.61: v95.89,48.9 v99.69,48.9 | v22.23,48.9 IC2.5 | v31.11,48.9 IC7.14 | IC4.3 v52.7,48.9 IC4.14 | IC6.14 v74.3,48.9 IC6.3 | v99.69,30.48 v97.16,30.48

### Text on the board
tPlace: Shruthi-1 | Mutable instruments | CV1> | CV2> | Q> | F> | VCA> | OSC> | GND | +5V
tNames: IN | OUT | SMR-4 is back v0.1